# EasyEDA Pro project pcb.epro

# Board PCB
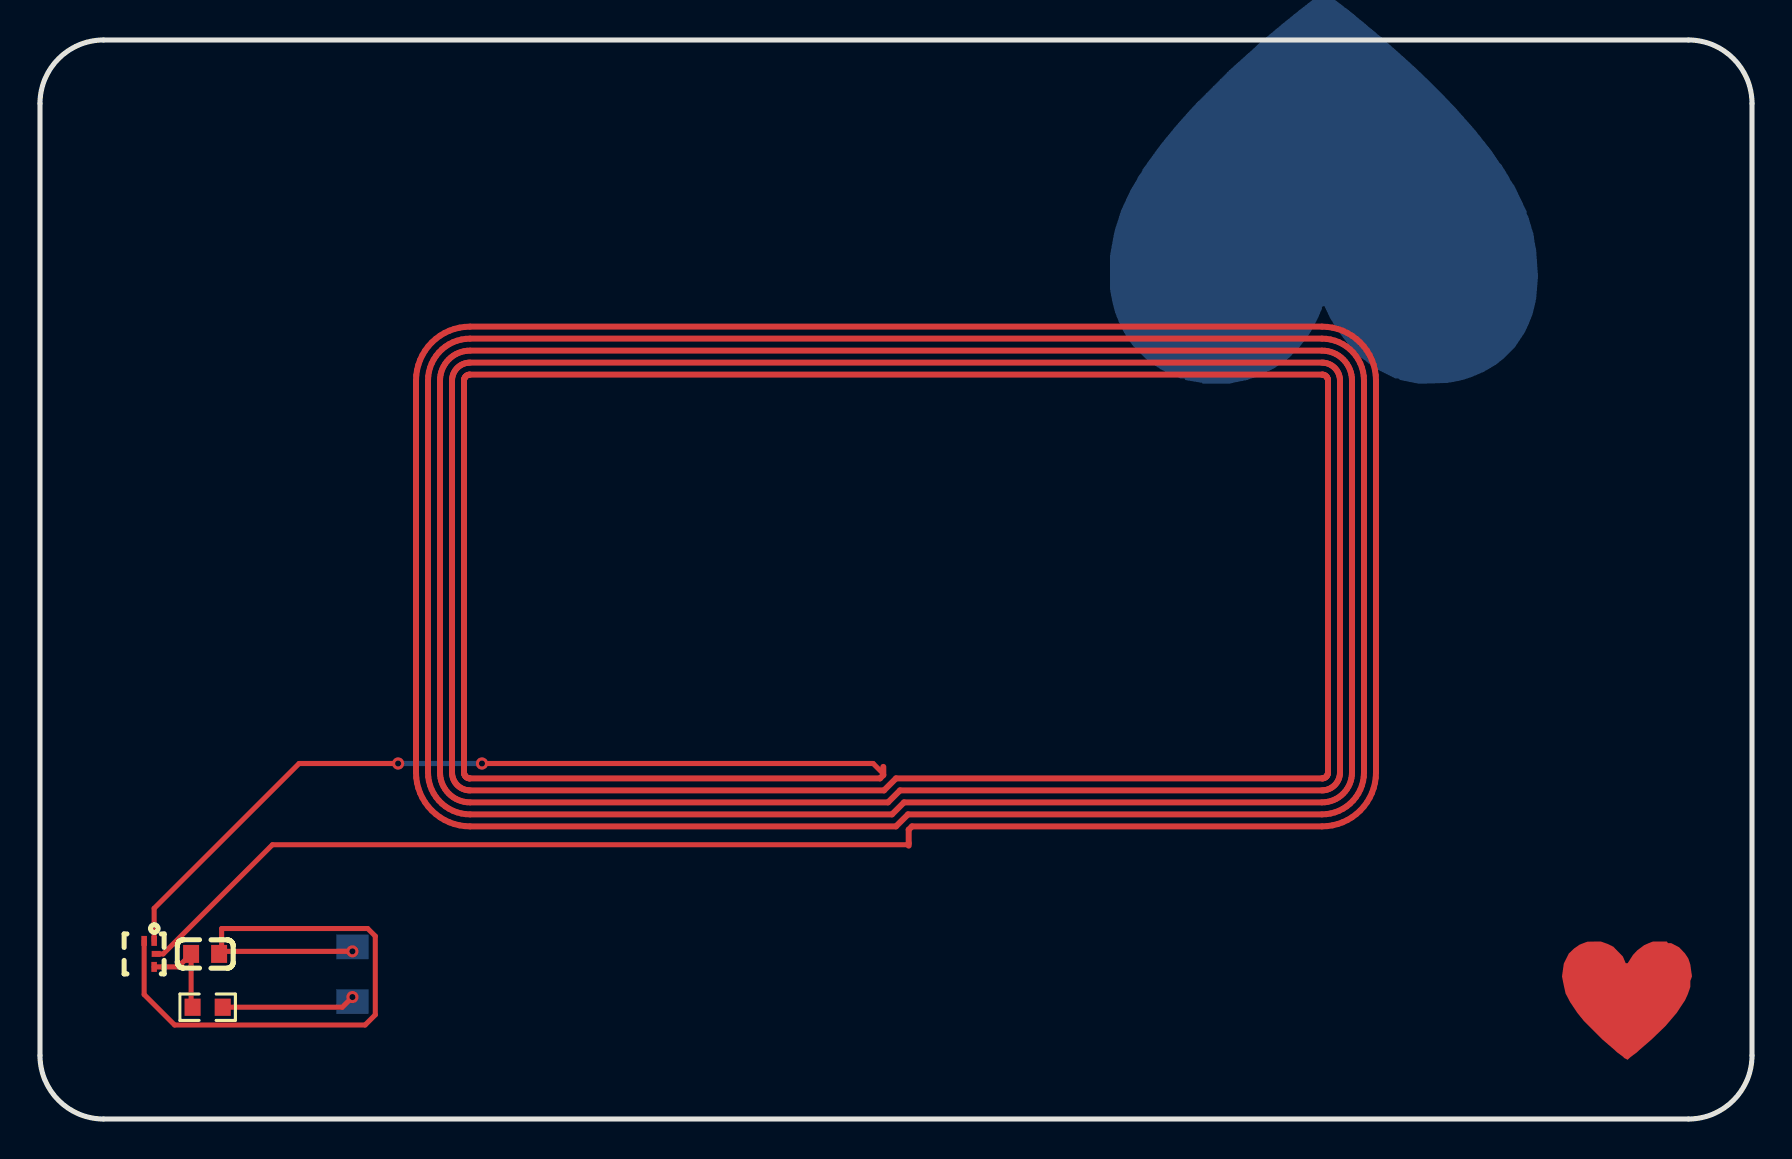
[diagram p0: board, top side]
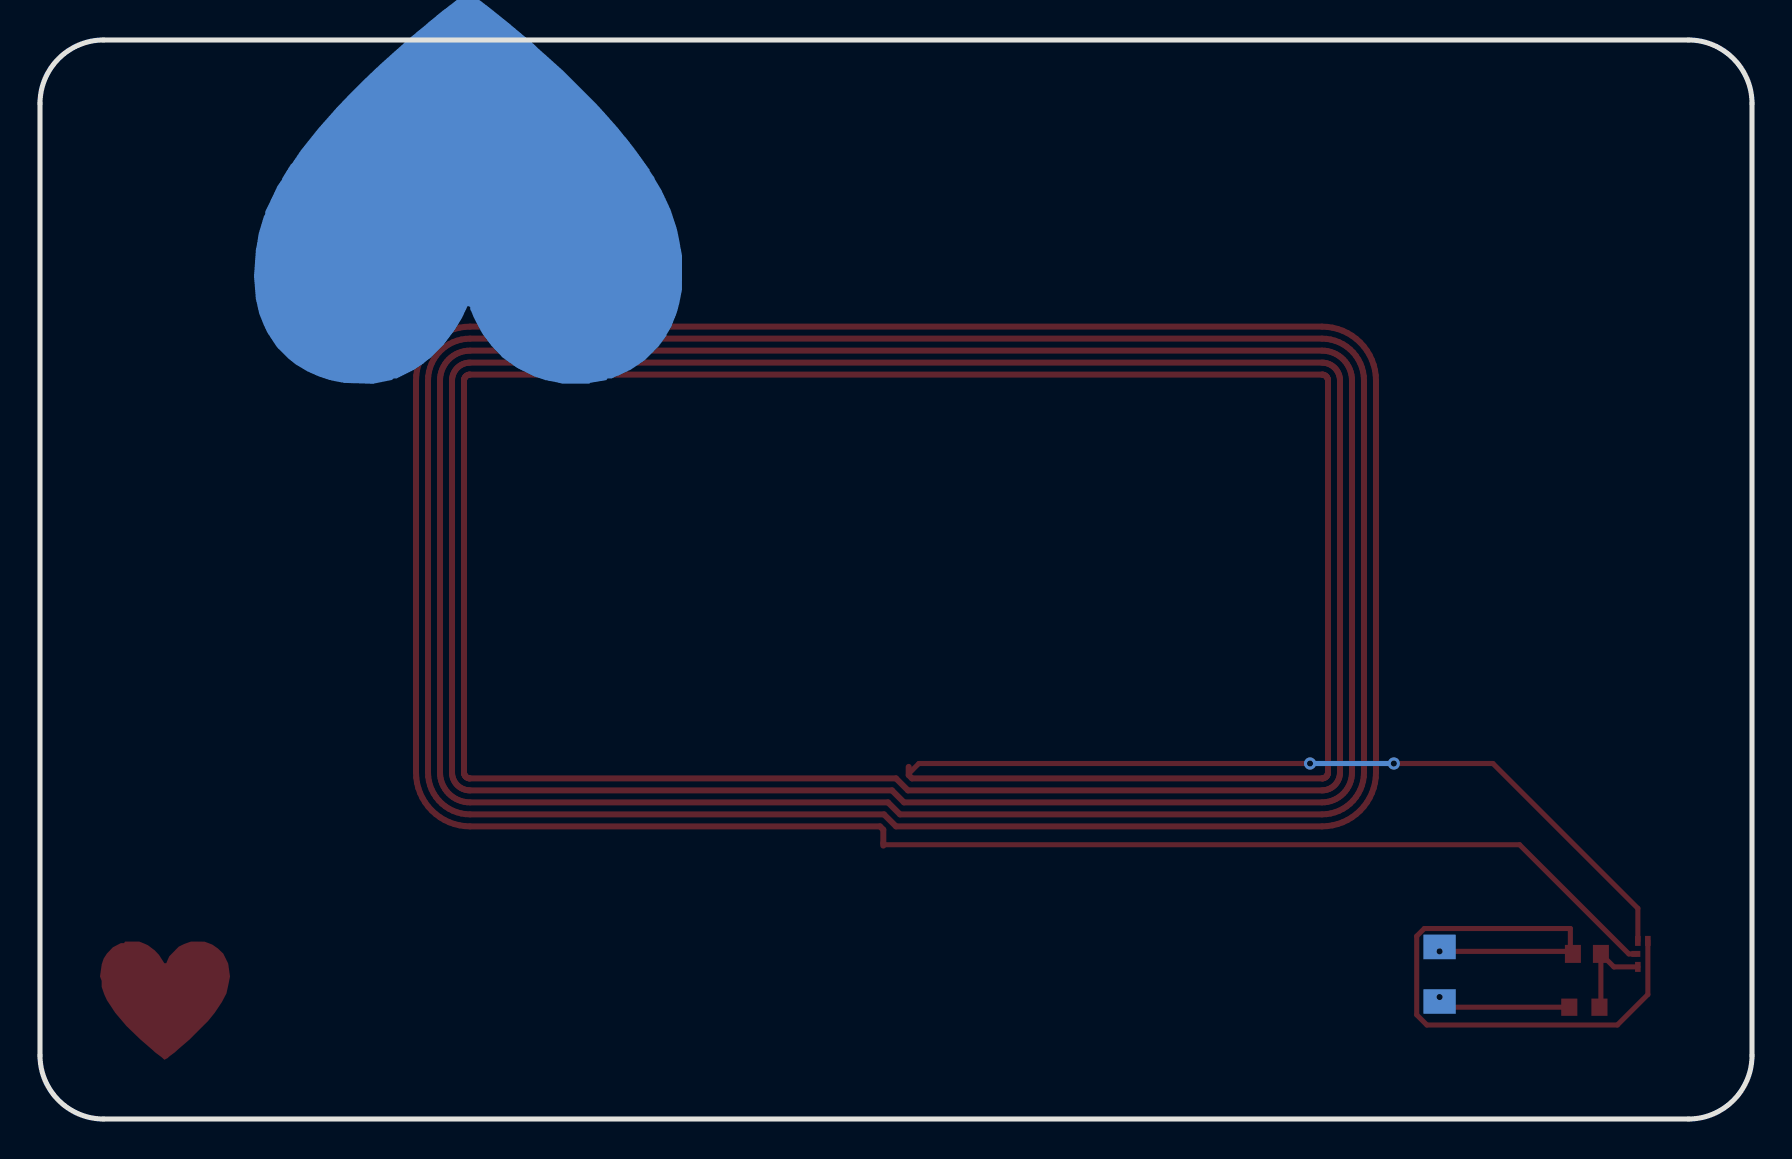
[diagram p1: board, bottom side, seen from below]

Outline 85.6 x 53.98 mm; copper layers: Top Layer, Bottom Layer. Coordinates in mm from the lower left corner of the outline.
Outline path: 0,50.8 0,3.18 arc(0.93,0.93) 3.18,0 82.42,0 arc(84.67,0.93) 85.6,3.18 85.6,50.8 arc(84.67,53.05) 82.42,53.98 3.18,53.98 arc(0.93,53.05) 0,50.8
Stack: Top Layer 0.035mm - / Dielectric1 0.71mm FR4 er 4.5 / Bottom Layer 0.035mm -

## Design rules (mm)
template: JLCPCB Capability(Two Layers Board)
spacing copperThickness1oz (default): track to track 0.102, other pairs 0.152 to 0.3
spacing copperThickness2oz: track to track 0.203, other pairs 0.152 to 0.3
track width copperThickness1oz (default): min 0.127, default 0.254, max 2.54
track width copperThickness2oz: min 0.203, default 0.254, max 2.54
differential pair differentialPair (default): width min 0.127, default 0.254, max 2.54; gap min 0.152, default 0.152
via viaSize (default): diameter min 0.5, default 0.61, max 10; hole min 0.3, default 0.305, max 6.3

## Placement (name value [footprint] x y rotation side)
ANTENNA1  -  [25X48MM_NFC_ANTENNA]  42.8 27.14 180 top
C1  220nF  [C0603]  8.25 8.26 180 top
LED1  TJ-S3216SW9TGLCCW-A5  [LED1206-R-RD_WHITE]  15.62 7.24 90 bottom
R1  47Ω  [R0603]  8.38 5.59 180 top
U1  13.56MHz  [XQFN-8_L1.6-W1.6-P0.50-BL]  5.21 8.26 180 top

## Footprints (pads in the part's own frame, mm; a bottom-side part is the same pattern mirrored in y, then rotated)
C0603
  rect 0.8x0.9 smd: 1(-0.7,0) 2(0.7,0)
LED1206-R-RD_WHITE
  rect 1.232x1.62 smd: 1(1.367,0) 2(-1.367,0)
R0603
  rect 0.806x0.864 smd: 1(-0.753,0) 2(0.753,0)
XQFN-8_L1.6-W1.6-P0.50-BL
  rect 0.28x0.5 smd: 1(-0.5,-0.65) 2(0,-0.65) 7(-0.5,0.65)
  rect 0.45x0.3 smd: 8(-0.6,0)

## Nets
$1N546: U1.1
$1N550: U1.8
$1N564: C1.2 R1.2 U1.7
$1N1158: C1.1 LED1.2 U1.2
$1N1166: LED1.1 R1.1

## Via types
v1: diameter 0.61, hole 0.305, Top Layer to Bottom Layer, 4 vias

## Routing (per net, layer and track width the routed paths; a pad name or vN(x,y) marks a point on that pad's centre or on a via; arc(x,y) is an arc through that point)
$1N546: length 41.3
  Top Layer w0.254: 42.16,17.28 41.66,17.78 v1(22.1,17.78) ; v1(17.91,17.78) 12.95,17.78 5.71,10.54 U1.1
  Bottom Layer w0.254: v1(22.1,17.78) v1(17.91,17.78)
$1N550: length 39.9
  Top Layer w0.254: 5.81,8.26 6.16,8.26 11.62,13.72 43.43,13.72
$1N564: length 4.8
  Top Layer w0.254: R1.2 7.56,5.67 7.56,8.26 6.91,7.61 U1.7
$1N1158: length 6.7
  Top Layer w0.254: 9.14,5.59 15.11,5.59 v1(15.62,6.1)
$1N1166: length 34.7
  Top Layer w0.254: 9.08,8.39 9.08,9.53 16.38,9.53 16.76,9.15 16.76,5.21 16.26,4.7 6.73,4.7 5.21,6.23 5.21,8.91 ; 9.08,8.39 v1(15.62,8.39) ; 9.08,8.39 8.95,8.26

Small or netless copper shapes (teardrops, artwork), in the pictures only: 1 on Top Layer, 1 on Bottom Layer
